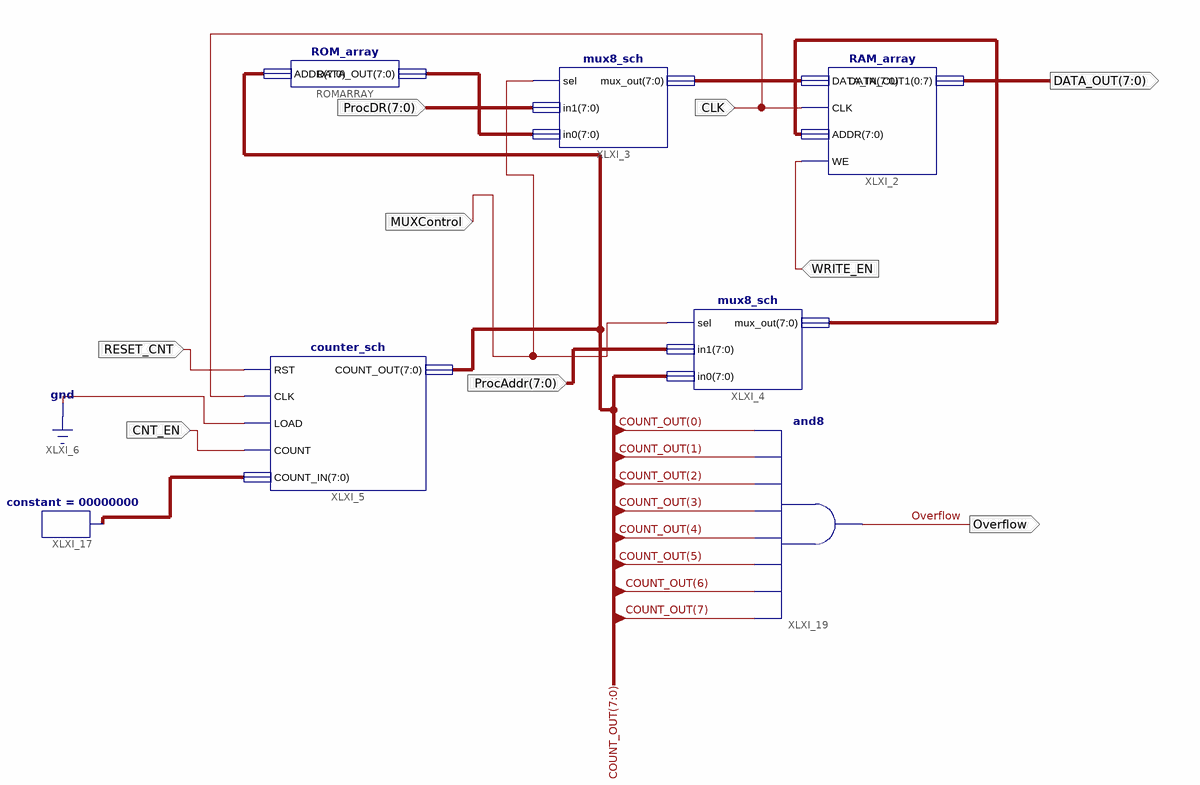
[diagram p0: schematic sheet 1]
// Xilinx ISE schematic mem_bootstrap.sch (spartan3e) as structural Verilog: 7 symbols, 9 ports
module mem_bootstrap (
  input  WRITE_EN,
  input  [7:0] ProcAddr,
  input  CLK,
  input  RESET_CNT,
  input  CNT_EN,
  input  [7:0] ProcDR,
  input  MUXControl,
  output [7:0] DATA_OUT,
  output Overflow
);

  wire [7:0] COUNT_OUT, XLXN_3, XLXN_12, XLXN_17, XLXN_19;

  ROM_array ROMARRAY (.ADDR(COUNT_OUT), .DATA_OUT(XLXN_12));
  RAM_array XLXI_2 (.ADDR(XLXN_3), .DATA_IN(XLXN_17), .WE(WRITE_EN), .CLK(CLK), .DATA_OUT1(DATA_OUT));
  mux8_sch XLXI_3 (.sel(MUXControl), .in1(ProcDR), .in0(XLXN_12), .mux_out(XLXN_17));
  mux8_sch XLXI_4 (.sel(MUXControl), .in1(ProcAddr), .in0(COUNT_OUT), .mux_out(XLXN_3));
  counter_sch XLXI_5 (
    .RST(RESET_CNT), .CLK(CLK), .LOAD(1'b0), .COUNT(CNT_EN), .COUNT_IN(XLXN_19), .COUNT_OUT(COUNT_OUT));
  constant #(.CValue("00000000")) XLXI_17 (.O(XLXN_19));
  and XLXI_19 (Overflow, COUNT_OUT[7], COUNT_OUT[6], COUNT_OUT[5], COUNT_OUT[4], COUNT_OUT[3], COUNT_OUT[2], COUNT_OUT[1], COUNT_OUT[0]);
endmodule
